# EAGLE design doorwatchV2 (EAGLE 6.0)

## Sheet 1 of 4: Power Supply
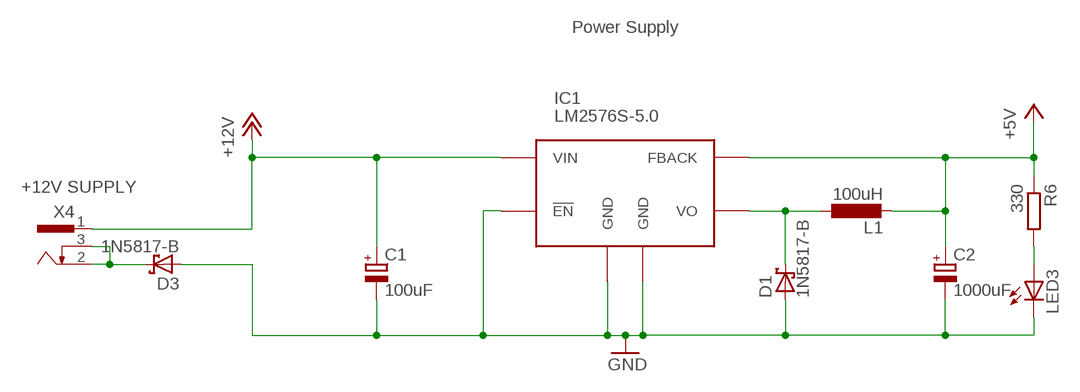
[diagram p0: schematic, sheet 1]

### Parts
C1  100uF  CPOL-EUE2.5-7  [E2,5-7]
C2  1000uF  CPOL-EUE5-10.5  [E5-10,5]
D1  1N5817-B  [DO41-7.6]
D3  1N5817-B  [DO41-7.6]
IC1  LM2576S-5.0  LM2576S  [TO263-5]
L1  100uH  L-EU2200-20.32  [2200-20.32]
LED3  LEDCHIP-LED0805  [CHIP-LED0805]
R6  330  R-EU_M0805  [M0805]
X4  733980-62  [733980-62]

### Nets
+5V: C2.+ IC1.4(FBACK) L1.2 R6.1 ; also sheet 2,3
+12V: C1.+ IC1.1(VIN) X4.1 ; also sheet 3
GND: C1.- C2.- D1.A D3.A IC1.3(GND) IC1.5(!EN) IC1.TAB(GND) LED3.C ; also sheet 2,3
N$3: D1.C IC1.2(VO) L1.1
N$15: D3.C X4.2 X4.3
N$18: LED3.A R6.2

### Notes on the sheet
- Power Supply
- +12V SUPPLY

## Sheet 2 of 4: Raspberry Pi
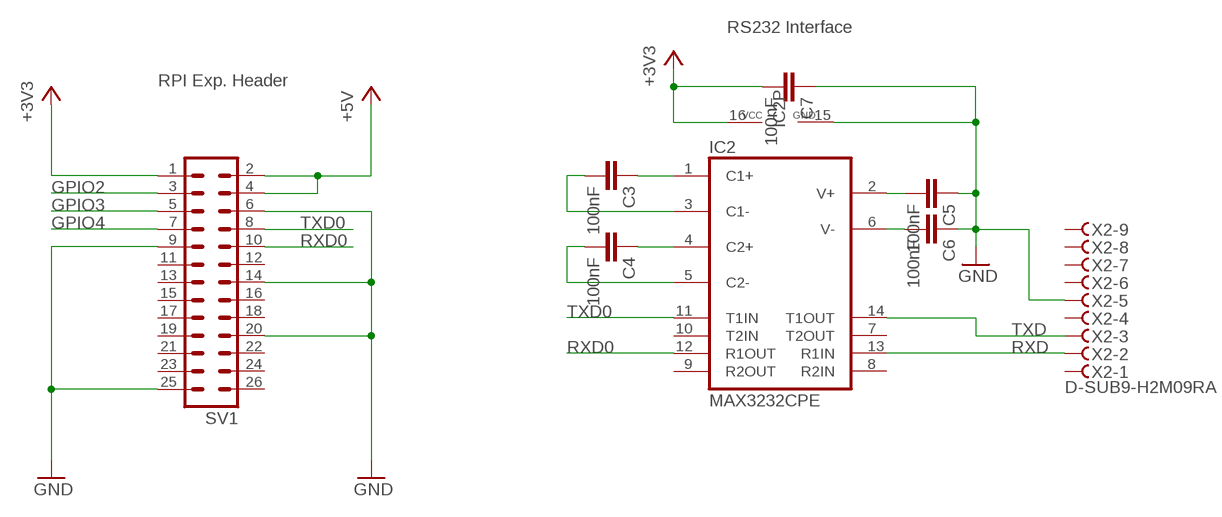
[diagram p1: schematic, sheet 2]

### Parts
C3  100nF  C-EUC0805  [C0805]
C4  100nF  C-EUC0805  [C0805]
C5  100nF  C-EUC0805  [C0805]
C6  100nF  C-EUC0805  [C0805]
C7  100nF  C-EUC0805  [C0805]
IC2  MAX3232CPE  [DIL16]
SV1  ML26  [ML26]
X2  D-SUB9-H2M09RA  [H2M09RA]

### Nets
+3V3: C7.2 IC2.16(VCC) SV1.1
+5V: SV1.2 SV1.4 ; also sheet 1,3
GND: C5.1 C6.1 C7.1 IC2.15(GND) SV1.6 SV1.9 SV1.14 SV1.20 SV1.25 X2.5 ; also sheet 1,3
GPIO2: SV1.3 ; also sheet 3
GPIO3: SV1.5 ; also sheet 3
GPIO4: SV1.7 ; also sheet 3
N$1: C3.1 IC2.1(C1+)
N$2: C4.1 IC2.4(C2+)
N$4: C3.2 IC2.3(C1-)
N$5: C4.2 IC2.5(C2-)
N$6: C6.2 IC2.6(V-)
N$7: C5.2 IC2.2(V+)
RXD: IC2.13(R1IN) X2.2
RXD0: IC2.12(R1OUT) SV1.10
TXD: IC2.14(T1OUT) X2.3
TXD0: IC2.11(T1IN) SV1.8
Unconnected: IC2.7(T2OUT) IC2.8(R2IN) IC2.9(R2OUT) IC2.10(T2IN) SV1.11 SV1.12 SV1.13 SV1.15 SV1.16 SV1.17 SV1.18 SV1.19 SV1.21 SV1.22 SV1.23 SV1.24 SV1.26 X2.1 X2.4 X2.6 X2.7 X2.8 X2.9

### Notes on the sheet
- RS232 Interface
- RPI Exp. Header

## Sheet 3 of 4: Actuators
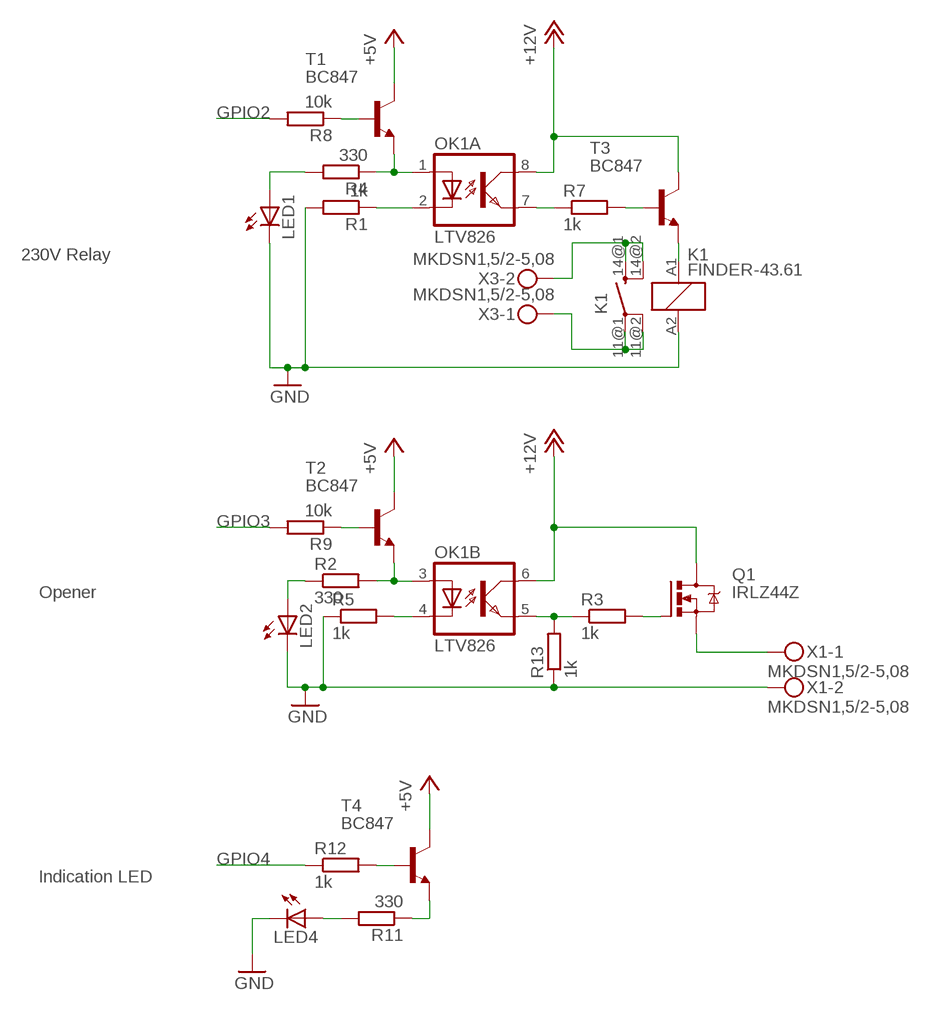
[diagram p2: schematic, sheet 3]

### Parts
K1  FINDER-43.61  [FINDER-43.61]
LED1  LEDCHIP-LED0805  [CHIP-LED0805]
LED2  LEDCHIP-LED0805  [CHIP-LED0805]
LED4  LEDCHIP-LED0805  [CHIP-LED0805]
OK1  LTV826  [DIL08]
Q1  IRLZ44Z  [TO220BH]
R1  1k  R-EU_M0805  [M0805]
R2  330  R-EU_M0805  [M0805]
R3  1k  R-EU_M0805  [M0805]
R4  330  R-EU_M0805  [M0805]
R5  1k  R-EU_M0805  [M0805]
R7  1k  R-EU_M0805  [M0805]
R8  10k  R-EU_M0805  [M0805]
R9  10k  R-EU_M0805  [M0805]
R11  330  R-EU_M0805  [M0805]
R12  1k  R-EU_M0805  [M0805]
R13  1k  R-EU_M0805  [M0805]
T1  BC847  [SOT23]
T2  BC847  [SOT23]
T3  BC847  [SOT23]
T4  BC847  [SOT23]
X1  MKDSN1,5/2-5,08  [MKDSN1,5/2-5,08]
X3  MKDSN1,5/2-5,08  [MKDSN1,5/2-5,08]

### Nets
+5V: T1.3(C) T2.3(C) T4.3(C) ; also sheet 1,2
+12V: OK1.6(B:COL) OK1.8(A:COL) Q1.D T3.3(C) ; also sheet 1
GND: K1.A2 LED1.C LED2.C LED4.C R1.2 R5.1 R13.1 X1.2 ; also sheet 1,2
GPIO2: R8.2 ; also sheet 2
GPIO3: R9.2 ; also sheet 2
GPIO4: R12.1 ; also sheet 2
N$8: OK1.3(B:A) R2.2 T2.2(E)
N$9: LED2.A R2.1
N$10: OK1.1(A:A) R4.1 T1.2(E)
N$11: OK1.4(B:C) R5.2
N$12: LED1.A R4.2
N$13: Q1.S X1.1
N$14: OK1.2(A:C) R1.1
N$16: OK1.5(B:EMIT) R3.1 R13.2
N$17: Q1.G R3.2
N$19: R9.1 T2.1(B)
N$20: OK1.7(A:EMIT) R7.1
N$21: R7.2 T3.1(B)
N$22: K1.11@1(-1:PA) K1.11@2(-1:PB) X3.1
N$23: K1.14@1(-1:SA) K1.14@2(-1:SB) X3.2
N$24: R8.1 T1.1(B)
N$25: K1.A1 T3.2(E)
N$27: R12.2 T4.1(B)
N$28: R11.1 T4.2(E)
N$29: LED4.A R11.2

### Notes on the sheet
- 230V Relay
- Opener
- Indication LED

## Sheet 4 of 4: Drills
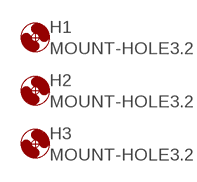
[diagram p3: schematic, sheet 4]

### Parts
H1  MOUNT-HOLE3.2  [3,2]
H2  MOUNT-HOLE3.2  [3,2]
H3  MOUNT-HOLE3.2  [3,2]

## Library data of the parts
C1 C2 = rcl:CPOL-EU: POLARIZED CAPACITOR, European symbol
C3-C7 = rcl:C-EU: CAPACITOR, European symbol
D1 D3 = diode:1N581*: 1.0A SCHOTTKY BARRIER RECTIFIER Source: http://www.diodes.com/datasheets/ds23001.pdf
H1-H3 = holes:MOUNT-HOLE: MOUNTING HOLE with drill center marker
IC1 = regulators:LM2576: Texas Instruments LM2576 Simple Switcher
IC2 = maxim:MAX3232*: True RS-232 Transceivers 3.0V to 5.5V, Low-Power up to 1Mbps, Using Four 0.1µF External Capacitors Source: http://pdfserv.maxim-ic.com/en/ds/MAX3222-MAX3241.pdf; MF: MAXIM; MPN: MAX3232CPE+; OC_FARNELL: 9724494; OC_NEWARK: 68K4626
K1 = relay:FINDER-43.61: Low profile PCB relays 10 - 16 A FINDER 43 Series Kontakt max. AC- 250V, Strom - Kontakt AC- max. 10A 5 mm contact pin pitch, 1 Pole NO, 16 A, PCB mount Distributor: FARNELL Source: http://www.farnell.com/datasheets/87682.pdf; OC_FARNELL: unknown; OC_NEWARK: unknown
L1 = rcl:L-EU: INDUCTOR, European symbol
LED1-LED4 = led:LED: LED OSRAM: - CHIPLED LG R971, LG N971, LY N971, LG Q971, LY Q971, LO R971, LY R971 LH N974, LH R974 LS Q976, LO Q976, LY Q976 LO Q996 - Hyper CHIPLED LW Q18S LB Q993, LB Q99A, LB R99A - SideLED LS A670, LO A670, LY A670, LG A670, LP A670 LB A673, LV A673, LT A673, LW A673 LH A674 LY A675 LS A676, LA A676, LO A676, LY A676, LW A676 LS A679, LY A679, LG A679 - Hyper Micro SIDELED® LS Y876, LA Y876, LO Y876, LY Y876 LT Y87S - SmartLED LW L88C, LW L88S LB L89C, LB L89S, LG L890 LS L89K, LO L89K, LY L89K LS L896, LA L896, LO L896, LY L896 - TOPLED LS T670, LO T670, LY T670, LG T670, LP T670 LSG T670, LSP T670, LSY T670, LOP T670, LYG T670 LG T671, LOG T671, LSG T671 LB T673, LV T673, LT T673, LW T673 LH T674 LS T676, LA T676, LO T676, LY T676, LB T676, LH T676, LSB T676, LW T676 LB T67C, LV T67C, LT T67C, LS T67K, LO T67K, LY T67K, LW E67C LS E67B, LA E67B, LO E67B, LY E67B, LB E67C, LV E67C, LT E67C LW T67C LS T679, LY T679, LG T679 LS T770, LO T770, LY T770, LG T770, LP T770 LB T773, LV T773, LT T773, LW T773 LH T774 LS E675, LA E675, LY E675, LS T675 LS T776, LA T776, LO T776, LY T776, LB T776 LHGB T686 LT T68C, LB T68C - Hyper Mini TOPLED® LB M676 - Mini TOPLED Santana® LG M470 LS M47K, LO M47K, LY M47K Source: http://www.osram.convergy.de LUXEON: - LUMILED® LXK2-PW12-R00, LXK2-PW12-S00, LXK2-PW14-U00, LXK2-PW14-V00 LXK2-PM12-R00, LXK2-PM12-S00, LXK2-PM14-U00 LXK2-PE12-Q00, LXK2-PE12-R00, LXK2-PE12-S00, LXK2-PE14-T00, LXK2-PE14-U00 LXK2-PB12-K00, LXK2-PB12-L00, LXK2-PB12-M00, LXK2-PB14-N00, LXK2-PB14-P00, LXK2-PB14-Q00 LXK2-PR12-L00, LXK2-PR12-M00, LXK2-PR14-Q00, LXK2-PR14-R00 LXK2-PD12-Q00, LXK2-PD12-R00, LXK2-PD12-S00 LXK2-PH12-R00, LXK2-PH12-S00 LXK2-PL12-P00, LXK2-PL12-Q00, LXK2-PL12-R00 Source: www.luxeon.com KINGBRIGHT: KA-3528ASYC Source: www.kingbright.com
OK1 = optocoupler:LTV826: OPTO COUPLER Source: LITEON, LTV816.pdf; OC_FARNELL: unknown; OC_NEWARK: unknown
Q1 = transistor-power:IRLZ44Z: N-Channel HEXFET® Power MOSFET Logic Level AUTOMOTIVE MOSFET Source: http://www.irf.com/product-info/datasheets/data/irlz44zpbf.pdf
R1-R9 R11-R13 = rcl:R-EU_: RESISTOR, European symbol
SV1 = con-harting-ml:ML26: HARTING; OC_FARNELL: unknown; OC_NEWARK: unknown
T1-T4 = transistor:BC847: NPN TRANSISTOR
X1 X3 = con-phoenix-508:MKDSN1,5/2-5,08: MKDSN 1,5/ 2-5,08 Printklemme Nennstrom: 13,5 A Nennspannung: 250 V Rastermaß: 5,08 mm Polzahl: 2 Anschlussart: Schraubanschluss Montage: Löten Anschlussrichtung Leiter/Platine: 0 ° Artikelnummer: 1729128 Source: http://eshop.phoenixcontact.com .. 1729128.pdf; MPN: MKDSN 1,5/2-5.08; OC_FARNELL: 1792903; OC_NEWARK: 30M2397
X2 = con-thomas-betts:D-SUB9-: D-Subminiatur Connector Source: Electronioc Interconnects European Edition 1998; OC_FARNELL: unknown; OC_NEWARK: unknown
X4 = con-conrad:73398?: FEMALE PRINT CONNECTOR Niedervolt-Steckverbinder Distributor Conrad

## Board
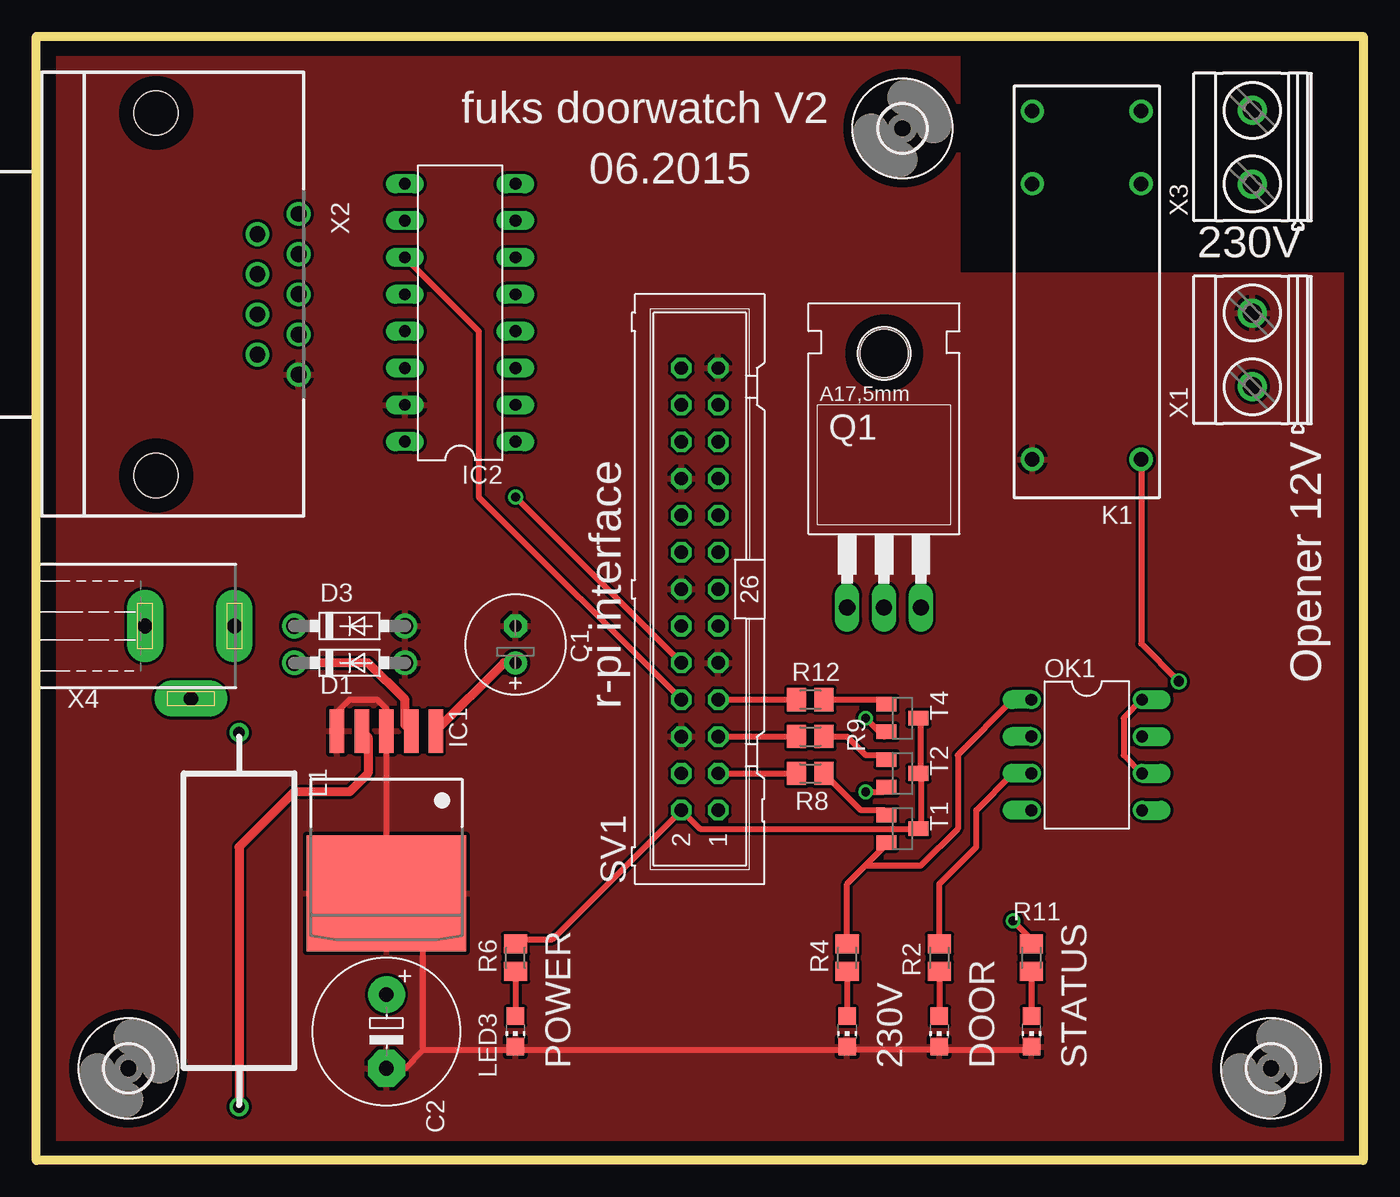
[diagram p4: board, top side]
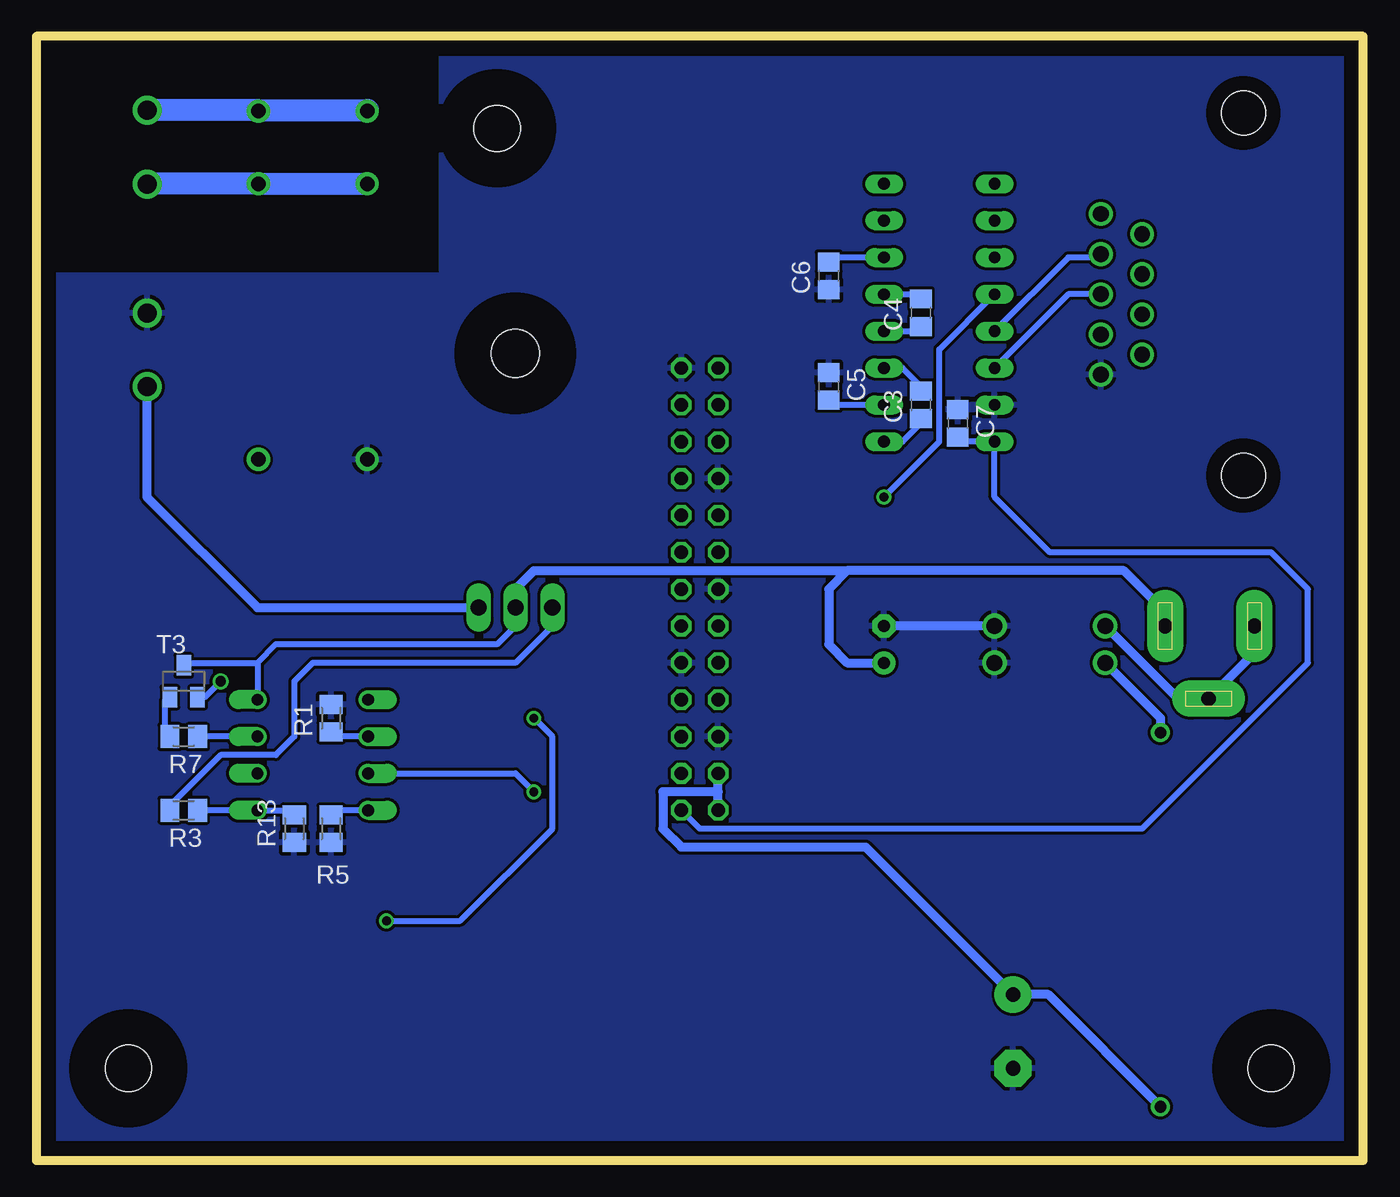
[diagram p5: board, bottom side, seen from below]

Size 91.44 x 77.47 mm. Coordinates in mm from the lower left corner, seen from the top.
Outline: 0,77.47 91.44,77.47 91.44,0 0,0 0,77.47
Copper layers (1*16): Top 0.035mm / dielectric 1.5mm / Bottom 0.035mm
Design rules: minimum track width 16mil, minimum drill 24mil, track to track 8mil, track to pad 8mil, pad to pad 8mil, via to via 8mil, smd to smd 8mil, copper to edge 40mil, drill to drill 8mil, minimum pad ring 10mil, minimum via ring 8mil, stop-mask expansion 4mil, vias tented up to drill 0mil, thermal gap 10mil

### Footprints (pad centres in the part's own frame; a part is rotated, then mirrored left to right if it is on the bottom)
E2,5-7 = drill 0.813 pad 1.6: + -1.27,0 | drill 0.813 pad 1.6 octagon: - 1.27,0
E5-10,5 = drill 1.016 pad 2.54: + -2.54,0 | drill 1.016 pad 2.54 octagon: - 2.54,0
C0805 = smd 1.3 x 1.5: 1 -0.95,0; 2 0.95,0
DO41-7.6 = drill 1.1 pad 1.7: A 3.81,0; C -3.81,0
3,2 = hole 3.2: 0,0
TO263-5 = smd 1 x 3: 1 -3.4,-8; 2 -1.7,-8; 3 0,-8; 4 1.7,-8; 5 3.4,-8 | smd 11 x 8: TAB 0,3.175
DIL16 = drill 0.813 long: 1 -8.89,-3.81; 2 -6.35,-3.81; 3 -3.81,-3.81; 4 -1.27,-3.81; 5 1.27,-3.81; 6 3.81,-3.81; 7 6.35,-3.81; 8 8.89,-3.81; 9 8.89,3.81; 10 6.35,3.81; 11 3.81,3.81; 12 1.27,3.81; 13 -1.27,3.81; 14 -3.81,3.81; 15 -6.35,3.81; 16 -8.89,3.81
FINDER-43.61 = drill 1 pad 1.6: 11@1 0,3.75; 11@2 0,-3.75; 14@1 5,3.75; 14@2 5,-3.75; A1 -19,-3.75; A2 -19,3.75
2200-20.32 = drill 0.8 pad 1.27: 1 -7.89,0; 2 17.89,0
CHIP-LED0805 = smd 1.2 x 1.2: A 0,-1.05; C 0,1.05
DIL08 = drill 0.813 offset: 1 -3.81,-3.81; 2 -1.27,-3.81; 3 1.27,-3.81; 4 3.81,-3.81; 5 3.81,3.81; 6 1.27,3.81; 7 -1.27,3.81; 8 -3.81,3.81
TO220BH = drill 1.118 long: D 0,-6.35; G -2.54,-6.35; S 2.54,-6.35 | hole 3.302: 0,11.176
M0805 = smd 1.3 x 1.6: 1 -0.95,0; 2 0.95,0
ML26 = drill 0.914 octagon: 1 -15.24,-1.27; 2 -15.24,1.27; 3 -12.7,-1.27; 4 -12.7,1.27; 5 -10.16,-1.27; 6 -10.16,1.27; 7 -7.62,-1.27; 8 -7.62,1.27; 9 -5.08,-1.27; 10 -5.08,1.27; 11 -2.54,-1.27; 12 -2.54,1.27; 13 0,-1.27; 14 0,1.27; 15 2.54,-1.27; 16 2.54,1.27; 17 5.08,-1.27; 18 5.08,1.27; 19 7.62,-1.27; 20 7.62,1.27; 21 10.16,-1.27; 22 10.16,1.27; 23 12.7,-1.27; 24 12.7,1.27; 25 15.24,-1.27; 26 15.24,1.27
SOT23 = smd 1 x 1.4: 1 -0.95,-1.1; 2 0.95,-1.1; 3 0,1.1
MKDSN1,5/2-5,08 = drill 1.3 pad 2: 1 -2.561,0.025; 2 2.519,0.025
H2M09RA = drill 1.092: 1 -5.537,7.925; 2 -2.769,7.925; 3 0,7.925; 4 2.769,7.925; 5 5.537,7.925; 6 -4.153,5.08; 7 -1.384,5.08; 8 1.384,5.08; 9 4.153,5.08 | hole 3.048: -12.497,-1.905; 12.497,-1.905
733980-62 = drill 1 pad 2.5 long: 1 0,8.57; 2 0,2.42; 3 5,5.57

### Placement (x,y rotation side)
C1  33.02,35.56 90 top
C2  24.13,8.89 270 top
C3  30.48,52.07 90 bottom
C4  30.48,58.42 90 bottom
C5  36.83,53.34 270 bottom
C6  36.83,60.96 90 bottom
C7  27.94,50.8 270 bottom
D1  21.59,34.29 0 top
D3  21.59,36.83 0 top
H1  6.35,6.35 0 top
H2  59.69,71.12 0 top
H3  85.09,6.35 0 top
IC1  24.13,21.59 180 top
IC2  29.21,58.42 90 top
K1  72.39,67.31 90 top
L1  13.97,21.59 270 top
LED1  55.88,8.89 180 top
LED2  62.23,8.89 180 top
LED3  33.02,8.89 180 top
LED4  68.58,8.89 180 top
OK1  72.39,27.94 270 top
Q1  58.42,44.45 0 top
R1  71.12,30.48 90 bottom
R2  62.23,13.97 90 top
R3  81.28,24.13 180 bottom
R4  55.88,13.97 270 top
R5  71.12,22.86 90 bottom
R6  33.02,13.97 270 top
R7  81.28,29.21 180 bottom
R8  53.34,26.67 180 top
R9  53.34,29.21 180 top
R11  68.58,13.97 270 top
R12  53.34,31.75 0 top
R13  73.66,22.86 90 bottom
SV1  45.72,39.37 90 top
T1  59.69,22.86 270 top
T2  59.69,26.67 270 top
T3  81.28,33.02 0 bottom
T4  59.69,30.48 270 top
X1  83.82,55.88 90 top
X2  10.16,59.69 270 top
X3  83.82,69.85 90 top
X4  5.08,36.83 270 top

### Tracks (layer width: path | path; a pad name or v marks a point on that pad's centre or on a via)
+3V3
  Bottom 0.406: C7.2 27.94,49.53 IC2.16 25.4,45.72 21.59,41.91 6.35,41.91 3.81,39.37 3.81,34.29 15.24,22.86 45.72,22.86 SV1.1
+5V
  Top 0.406: 60.96,26.67 60.96,22.86 T1.3 45.72,22.86 SV1.2 35.56,15.24 33.02,15.24 R6.1 | 60.96,26.67 60.96,30.48 T4.3 | 60.96,26.67 T2.3
  Top 0.61: IC1.4 22.86,29.16 22.86,26.67 21.59,25.4 17.78,25.4 13.97,21.59 L1.2
  Bottom 0.61: L1.2 21.7,11.43 C2.+
  Bottom 0.635: SV1.2 44.45,25.4 | 44.45,25.4 SV1.4 | C2.+ 34.29,21.59 46.99,21.59 48.26,22.86 48.26,25.4 44.45,25.4
+12V
  Top 0.406: OK1.6 74.93,27.94 74.93,30.48 OK1.8
  Top 0.61: IC1.1 32.23,34.29 C1.+
  Bottom 0.406: T3.3 81.28,34.29 76.2,34.29 | Q1.D 58.42,36.83 59.69,35.56 74.93,35.56 76.2,34.29 | 76.2,34.29 OK1.8
  Bottom 0.61: 57.15,40.64 35.56,40.64 | X4.1 13.65,37.78 16.51,40.64 35.56,40.64 | 35.56,40.64 36.83,39.37 36.83,35.56 35.56,34.29 C1.+
  Bottom 0.635: 57.15,40.64 58.42,39.37 Q1.D
GND
  Top 0.406: 62.23,7.62 55.88,7.62 | 62.23,7.62 68.58,7.62 LED4.C | 62.23,7.62 LED2.C | 26.67,7.62 33.02,7.62 | 33.02,7.62 55.88,7.62 | 55.88,7.62 LED1.C | 33.02,7.62 LED3.C | 26.67,7.62 26.67,15.24 24.13,17.78 IC1.TAB IC1.3 24.13,31.11 23.5,31.75 21.59,31.75 20.73,30.89 IC1.5 | C2.- 25.4,6.35 26.67,7.62
  Bottom 0.635: D3.A C1.-
  pour Top: 1.27,1.27 90.17,1.27 90.17,60.96 63.5,60.96 63.5,76.2 1.27,76.2
  pour Bottom: 1.27,76.2 63.5,76.2 63.5,60.96 90.17,60.96 90.17,1.27 1.27,1.27
GPIO2
  Top 0.406: SV1.3 R8.2
GPIO3
  Top 0.406: SV1.5 R9.2
GPIO4
  Top 0.406: SV1.7 R12.1
N$1
  Bottom 0.406: IC2.1 31.75,49.53 30.48,50.8 C3.1
N$2
  Bottom 0.406: IC2.4 30.48,57.15 C4.1
N$3
  Top 0.61: IC1.2 25.4,30.02 25.4,31.75 22.86,34.29 D1.C
  Bottom 0.61: D1.C 13.97,30.48 L1.1
N$4
  Bottom 0.406: IC2.3 31.75,54.61 30.48,53.34 C3.2
N$5
  Bottom 0.406: IC2.5 30.48,59.69 C4.2
N$6
  Bottom 0.406: IC2.6 36.83,62.23 C6.2
N$7
  Bottom 0.406: IC2.2 36.83,52.07 C5.2
N$8  (via drill 0.61)
  Top 0.406: v57.15,25.4 58.42,25.4 T2.2 | R2.2 62.23,19.05 64.77,21.59 64.77,24.13 67.31,26.67 OK1.3
  Bottom 0.406: v57.15,25.4 58.42,26.67 OK1.3
N$9
  Top 0.406: R2.1 LED2.A
N$10
  Top 0.406: 57.15,20.32 55.88,19.05 R4.1 | 57.15,20.32 58.42,21.59 T1.2 | 57.15,20.32 60.96,20.32 63.5,22.86 63.5,27.94 67.31,31.75 OK1.1
N$11
  Bottom 0.406: OK1.4 71.12,24.13 R5.2
N$12
  Top 0.406: R4.2 LED1.A
N$13
  Bottom 0.406: 83.82,53.34 X1.1
  Bottom 0.635: 83.82,53.34 83.82,45.72 76.2,38.1 Q1.S
N$14
  Bottom 0.406: OK1.2 71.12,29.21 R1.1
N$15
  Bottom 0.61: D3.C 12.78,31.83 X4.3 7.5,34.98 X4.2
N$16
  Bottom 0.406: R3.1 OK1.5 73.66,24.13 R13.2
N$17
  Bottom 0.406: Q1.G 55.88,36.83 58.42,34.29 72.39,34.29 73.66,33.02 73.66,29.21 74.93,27.94 78.74,27.94 82.55,24.13 R3.2
N$18
  Top 0.406: R6.2 LED3.A
N$19
  Top 0.406: R9.1 55.88,29.21 57.15,27.94 58.42,27.94 T2.1
N$20
  Bottom 0.406: OK1.7 R7.1
N$21
  Bottom 0.406: T3.1 82.55,31.75 82.55,29.21 R7.2
N$22
  Bottom 0.406: 68.58,67.31 K1.11@1 | 83.82,67.31 X3.1 | 76.2,67.31 K1.11@2
  Bottom 1.524: K1.11@2 K1.11@1 | 76.2,67.31 83.82,67.31
N$23
  Bottom 0.406: 68.58,72.39 K1.14@1 | 83.82,72.39 X3.2 | 76.2,72.39 K1.14@2
  Bottom 1.524: 68.58,72.39 76.2,72.39 83.82,72.39
N$24
  Top 0.406: T1.1 58.42,24.13 56.83,24.13 R8.1 54.61,26.67
N$25  (via drill 0.7 pad 0.41)
  Top 0.406: K1.A1 76.14,35.62 v78.74,33.02
  Bottom 0.406: v78.74,33.02 79.84,31.92 T3.2
N$27
  Top 0.406: R12.2 58.42,31.75 T4.1
N$28  (via drill 0.61)
  Top 0.406: v57.15,30.48 58.42,29.21 T4.2 | v67.31,16.51 68.58,15.24 R11.1
  Bottom 0.406: v67.31,16.51 62.23,16.51 55.88,22.86 55.88,29.21 v57.15,30.48
N$29
  Top 0.406: R11.2 LED4.A
RXD
  Bottom 0.406: IC2.13 20.32,62.23 17.78,62.23 X2.2
RXD0  (via drill 0.61)
  Top 0.406: SV1.10 v33.02,45.72
  Bottom 0.406: IC2.12 29.21,55.88 29.21,49.53 v33.02,45.72
TXD
  Bottom 0.406: IC2.14 20.32,59.69 X2.3 17.78,59.69
TXD0
  Top 0.406: SV1.8 30.48,45.72 30.48,57.15 IC2.11

### Text on the board
tPlace: 230V | Opener 12V | POWER | 230V | DOOR | STATUS
tNames: fuks doorwatch V2 | 06.2015 | r-pi interface